# Altium project PS.PrjPcb
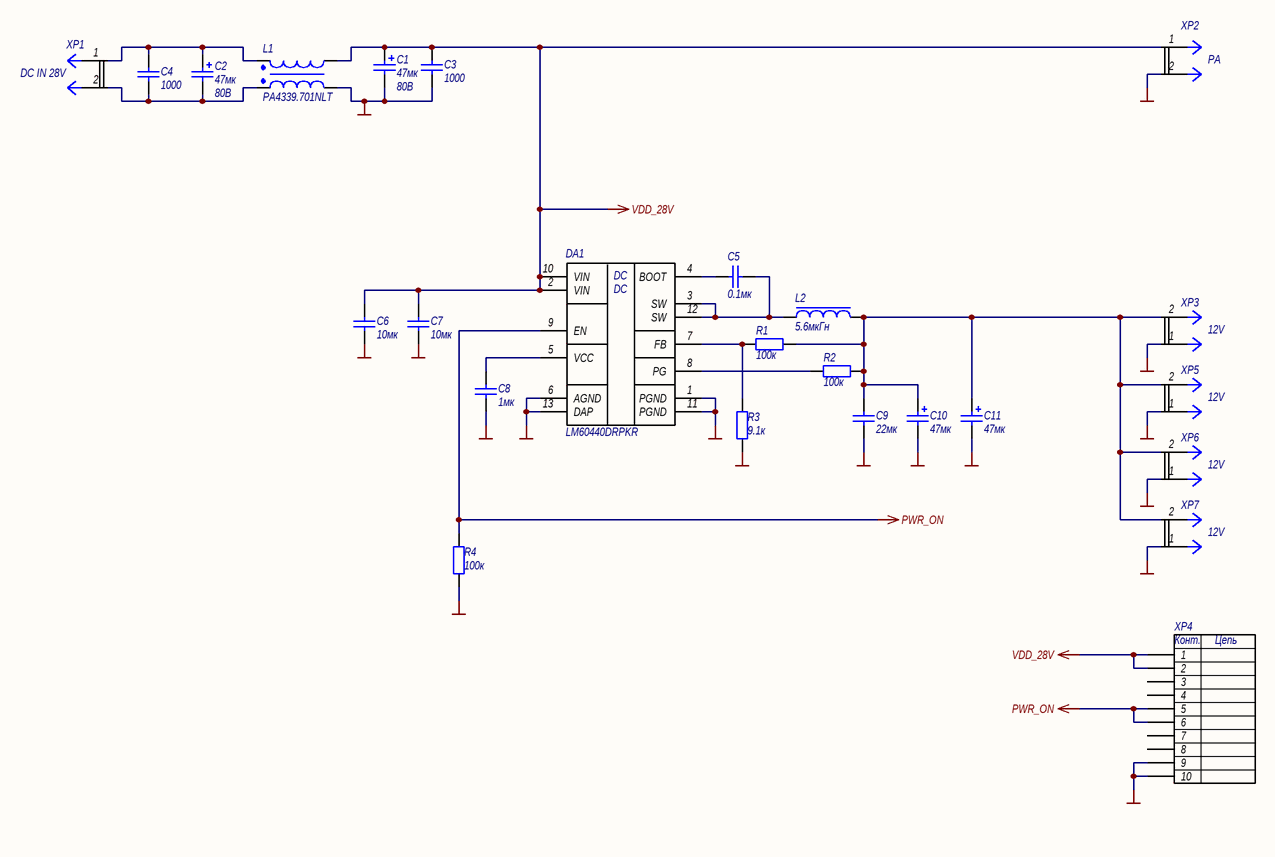
[diagram p0: PS.SchDoc]
1 sheet, 25 parts. Net scope: global (net labels, ports and power ports of the same name join across sheets).
Board file: PS.PcbDoc

## Sheet PS.SchDoc: Приемопередатчик  SDR200
size 420 x 297 mm; Author: В.Титов; DrawnBy: В.Титов; DocumentNumber: ХХХХ.468179.001 Э3; SheetNumber: 1; SheetTotal: 1; DocumentType: Схема электрическая принципиальная; Title2: Источник питания; Scale: 1:1

### Parts
C1  Power/Voltage: 80В  [CAPAE116103X105N]  (hidden comment: 47мк)
C2  Power/Voltage: 80В  [CAPAE116103X105N]  (hidden comment: 47мк)
C3  1000  [CAPC2012X12L]
C4  1000  [CAPC2012X12L]
C5  0.1мк  [CAPC1005X06N]
C6  10мк  [CAPC3225X27L]
C7  10мк  [CAPC3225X27L]
C8  1мк  [CAPC1005X06N]
C9  22мк  [CAPC2012X12L]
C10  47мк  [CAPMP7343X28L]
C11  47мк  [CAPMP7343X28L]
DA1  LM60440DRPKR  [WQFN-13]
L1  PA4339.701NLT  [HCCI-80-2]
L2  5.6мкГн  [Coilcraft-XAL5030]
R1  100к  [RESC1005X06N]
R2  100к  [RESC1005X06N]
R3  9.1к  [RESC1005X06N]
R4  100к  [RESC1005X06N]
XP1  XT60-F  [XT60-F]  (value not drawn)
XP2  XT60-F  [XT60-F]  (value not drawn)
XP3  XT30UPB-M  [XT30UPB-M]  (value not drawn)
XP4  FH12-10S-0.5SVA  [FH12-10S-0.5SH]  (value not drawn)
XP5  XT30UPB-M  [XT30UPB-M]  (value not drawn)
XP6  XT30UPB-M  [XT30UPB-M]  (value not drawn)
XP7  XT30UPB-M  [XT30UPB-M]  (value not drawn)

### Nets
GND: C1.2 C3.1 C6.1 C7.1 C8.1 C9.1 C10.2 C11.2 DA1.1(PGND) DA1.6(AGND) DA1.11(PGND) DA1.13(DAP) L1.3 R3.2 R4.2 XP2.2 XP3.1 XP4.9 XP4.10 XP5.1 XP6.1 XP7.1
PWR_ON: DA1.9(EN) R4.1 XP4.5 XP4.6
VDD_28V: C1.1 C3.2 C6.2 C7.2 DA1.2(VIN) DA1.10(VIN) L1.4 XP2.1 XP4.1 XP4.2
NetC2_1: C2.1 C4.2 L1.1 XP1.1
NetC2_2: C2.2 C4.1 L1.2 XP1.2
NetC5_1: C5.1 DA1.3(SW) DA1.12(SW) L2.1
NetC5_2: C5.2 DA1.4(BOOT)
NetC8_2: C8.2 DA1.5(VCC)
NetC9_2: C9.2 C10.1 C11.1 L2.2 R1.1 R2.1 XP3.2 XP5.2 XP6.2 XP7.2
NetDA1_7: DA1.7(FB) R1.2 R3.1
NetDA1_8: DA1.8(PG) R2.2

Not connected (* = marked no-connect by the designer): XP4 3 4 7 8

### Notes on the sheet
- (near XP2) PA
- (near XP1) DC IN 28V
- (near XP3) 12V
- (near XP5) 12V
- (near XP6) 12V
- (near XP7) 12V
- Перв. примен.
- Справ. №
- Подп. и дата
- Инв. № дубл.
- Взам. инв. №
- Изм
- Лист
- № докум
- Подп.
- Дата
- Лит.
- Масса
- Масштаб
- Т. контр.
- Разраб.
- Пров.
- Листов
- Н. контр.
- Инв. № подп.
- Утв.
- Копировал
- Формат А3
- (in symbol Микросхема LM60440DRPKR) DC
- (in symbol Соединитель FH12-10S-0.5SVA) Конт.; Цепь

### Library data of the parts
C1 C2 = Конденсатор гибридный SMD 47мкФ ±20% 80В: Гибридный ЧИП-конденсатор; ManufacturerPartNumber: EEHZC1K470V; Manufacturer: Panasonic; Tolerance: ±20%; Published: 8-Jun-2000; LatestRevisionDate: 29-May-2009; LatestRevisionNote: IPC-7351 Footprint Added.; Publisher: Altium Limited; PackageDescription: ZC Series - Anti-Vibration; PackageReference: ZC Series; Value: 47мк
C3 C4 = Кер.ЧИП конд. 0805 1000пФ X7R 10% 100В: Кер. ЧИП-конденсатор; Manufacturer: WALSIN; ManufacturerPartNumber: 0805B102K100; Power/Voltage: 100В; TKE: X7R; Tolerance: ±10%; Value: 1000
C5 = Кер.ЧИП конд. 0402 0.1мкФ X7R 10%, 16В: Кер. ЧИП-конденсатор; Power/Voltage: 16В; TKE: X7R; Tolerance: ±10%; PackageReference: 0402; Value: 0.1мк
C6 C7 = Кер.ЧИП конд. 1210 10мкФ X5R 20% 50В: Кер. ЧИП-конденсатор; Manufacturer: Murata; ManufacturerPartNumber: GRM32ER71H106; Power/Voltage: 50В; TKE: X5R; Tolerance: ±20%; Value: 10мк
C8 = Кер.ЧИП конд. 0402 1мкФ X5R 10%, 10В: Кер. ЧИП-конденсатор; Power/Voltage: 10В; TKE: X5R; Tolerance: ±10%; PackageReference: 0402; Value: 1мк
C9 = Кер.ЧИП конд. 0805 22мкФ X5R 10% 16В: Кер. ЧИП-конденсатор; Manufacturer: TDK; ManufacturerPartNumber: C2012X5R1C226KT; Power/Voltage: 16В; TKE: X5R; Tolerance: ±10%; Value: 22мк
C10 C11 = Конденсатор танталовый SMD D case 47мкФ ±10% 25B: Тант. ЧИП-конденсатор; Power/Voltage: 25В; Tolerance: ±10%; Value: 47мк; Published: 8-Jun-2000; LatestRevisionDate: 29-May-2009; LatestRevisionNote: IPC-7351 Footprint Added.; Publisher: Altium Limited; PackageDescription: Chip Capacitor; PackageReference: тип D
DA1 = Микросхема LM60440DRPKR: 3.8-V to 36-V, 4-A Ultra-Small Synchronous Step-Down Converter; Value: LM60440DRPKR; ComponentLink1Description: datasheet; ComponentLink1URL: https://www.ti.com/lit/ds/symlink/lm60440.pdf?HQS=dis-dk-null-digikeymode-dsf-pf-null-wwe&ts=1663282176250&ref_url=https%253A%252F%252Fwww.digikey.si%252F
L1 = ЧИП синфазный фильтр PG1265NL: SMT Common Mode Choke; Manufacturer: Pulse; ManufacturerPartNumber: PA4339.701NLT; Value: PA4339.701NLT; ComponentLink1Description: datasheet; ComponentLink1URL: https://products.pulseelex.com/files/product_files/P850.pdf
L2 = ЧИП индуктивность XAL5030-562MEB: Shielded Power Inductor – XAL5030; Manufacturer: Сoilcraft; ManufacturerPartNumber: XAL5030-222MEB; Value: 5.6мкГн
R1 R2 R4 = Чип резистор 0402 100 кОм, 5%: ЧИП-резистор; Tolerance: ±5%; TKE: 100 ppm/°С; PackageReference: 0402; Value: 100к
R3 = Чип резистор 0402 9,1 кОм, 5%: ЧИП-резистор; Tolerance: ±5%; TKE: 100 ppm/°С; PackageReference: 0402; Value: 9.1к
XP1 XP2 = Соединитель XT60-F: AMASS XT60-F; Value: XT60-F
XP3 XP5-XP7 = Соединитель XT30UPB-M: AMASS XT30UPB-M  5 mm; Value: XT30UPB-M
XP4 = Соединитель FH12-10S-0.5SVA: 0.5mm  Pitch FPC/FFC Connector FH12 Series; Manufacturer: Hirose; Value: FH12-10S-0.5SVA